# EAGLE design OSO-RING-A2-01 (EAGLE 9.6.2)
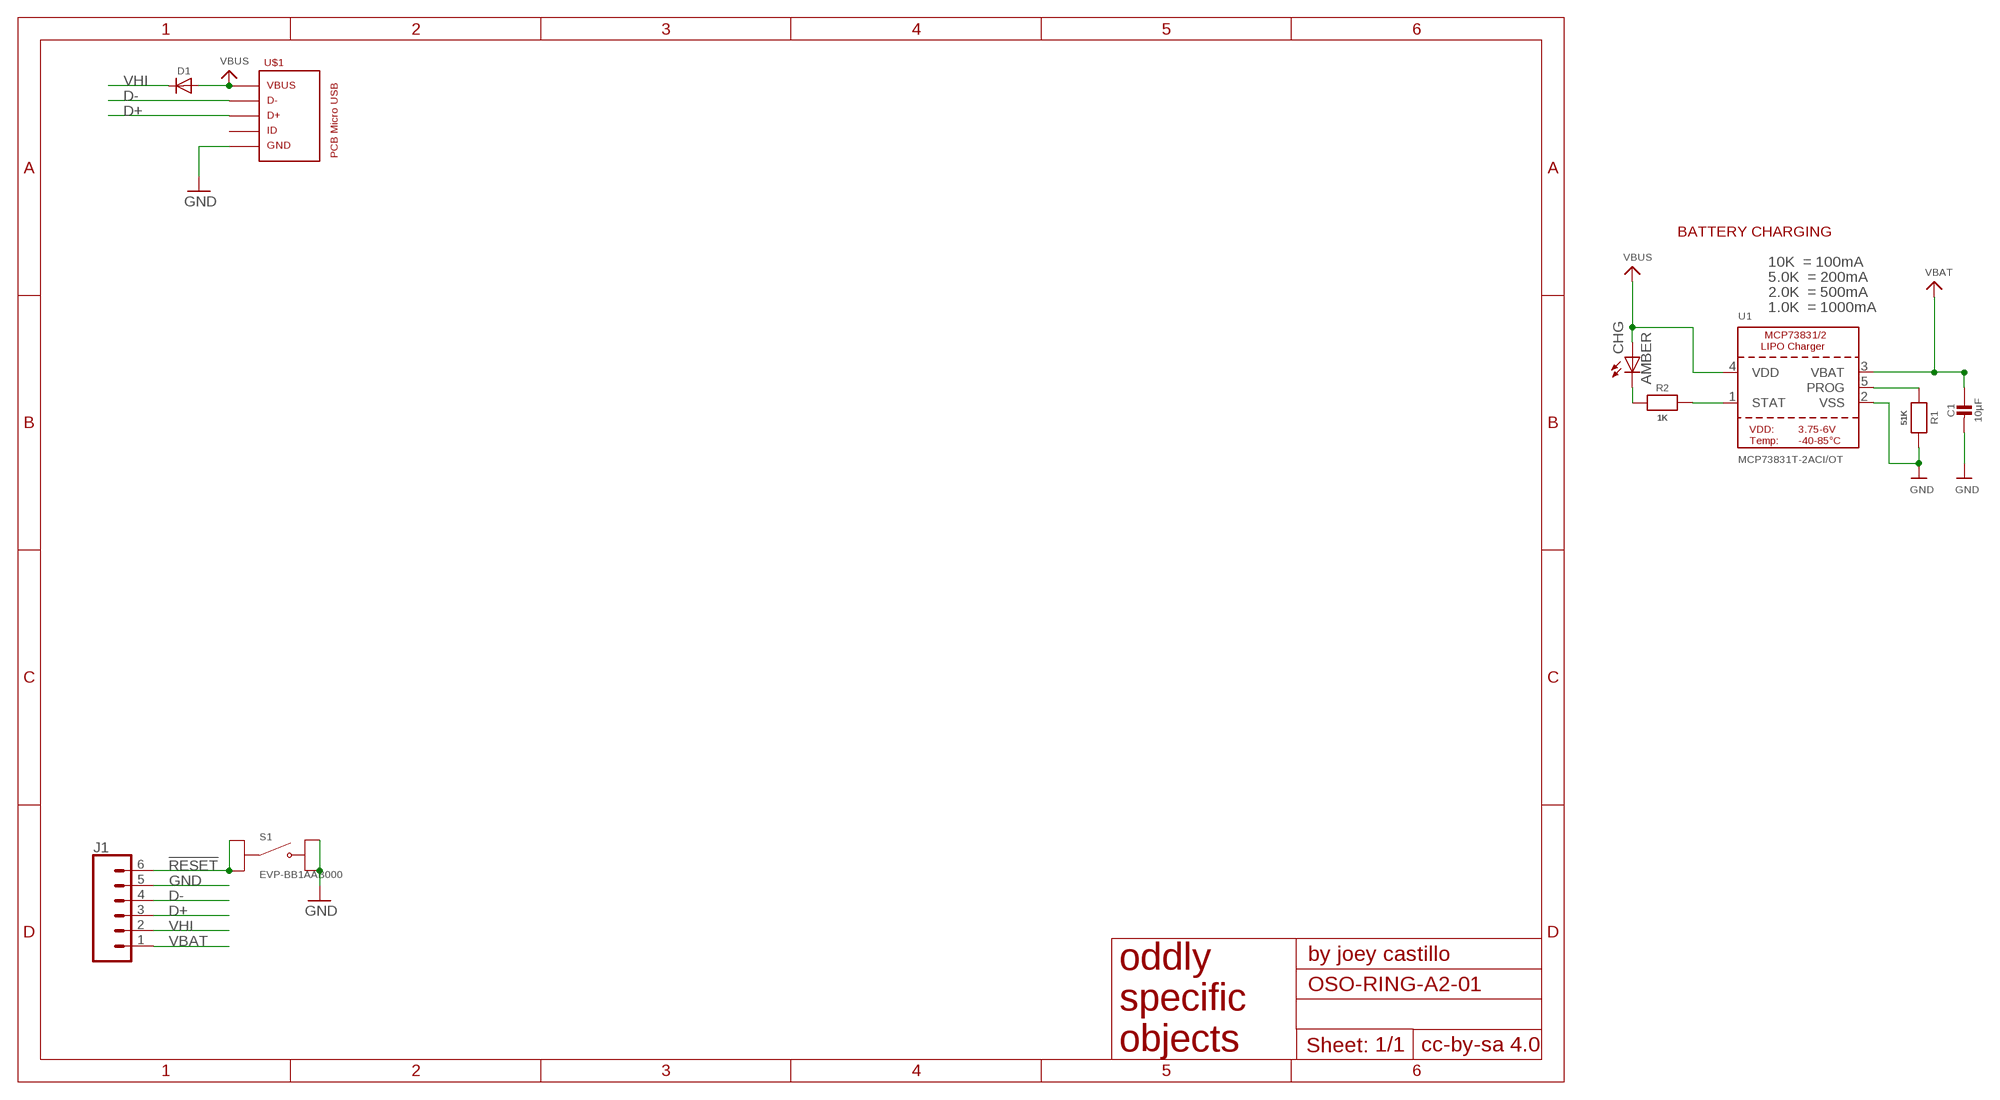
[diagram p0: schematic, sheet 1]

## Parts
C1  10µF  CAP_CERAMIC0603_NO  [0603-NO]
CHG  AMBER  LEDCHIPLED_0805  [CHIPLED_0805]
D1  MICROBUILDER_DIODESOD-323  [MICROBUILDER_SOD-323]
J1  CONN_06SMD-1MM  [1X06-1MM]
R1  51K  RESISTOR_0603_NOOUT  [0603-NO]
R2  1K  RESISTOR_0603_NOOUT  [0603-NO]
S1  EVP-BB1AAB000  [SW_EVP-BB1AAB000]
U1  MCP73831T-2ACI/OT  MCP73831/2  [SOT23-5]
U$1  PCB_MICRO_USB_BSS_100  [USB_TYPE_B_SS_100]

## Nets
!RESET: J1.6 S1.A1 S1.A2
D+: J1.3 U$1.3
D-: J1.4 U$1.2
GND: C1.2 J1.5 R1.2 S1.B1 S1.B2 U1.2(VSS) U$1.5
N$4: CHG.C R2.1
PROG: R1.1 U1.5(PROG)
STAT: R2.2 U1.1(STAT)
VBAT: C1.1 J1.1 U1.3(VBAT)
VBUS: CHG.A D1.A U1.4(VDD) U$1.1
VHI: D1.C J1.2
Unconnected: U$1.4

## Notes on the sheet
- BATTERY CHARGING
- 10K  = 100mA
- 5.0K  = 200mA
- 2.0K  = 500mA
- 1.0K  = 1000mA

## Library data of the parts
C1 = microbuilder:CAP_CERAMIC: Ceramic Capacitors For new designs, use the packages preceded by an '_' character since they are more reliable: The following footprints should be used on most boards: _0402 - Standard footprint for regular board layouts _0603 - Standard footprint for regular board layouts _0805 - Standard footprint for regular board layouts _1206 - Standard footprint for regular board layouts For extremely tight-pitch boards where space is at a premium, the following 'micro-pitch' footprints can be used (smaller pads, no silkscreen outline, etc.): _0402MP - Micro-pitch footprint for very dense/compact boards _0603MP - Micro-pitch footprint for very dense/compact boards _0805MP - Micro-pitch footprint for very dense/compact boards _1206MP - Micro-pitch footprint for very dense/compact boards
CHG = adafruit:LED: LED OSRAM: - CHIPLED LG R971, LG N971, LY N971, LG Q971, LY Q971, LO R971, LY R971 LH N974, LH R974 LS Q976, LO Q976, LY Q976 LO Q996 - Hyper CHIPLED LW Q18S LB Q993, LB Q99A, LB R99A - SideLED LS A670, LO A670, LY A670, LG A670, LP A670 LB A673, LV A673, LT A673, LW A673 LH A674 LY A675 LS A676, LA A676, LO A676, LY A676, LW A676 LS A679, LY A679, LG A679 - Hyper Micro SIDELED® LS Y876, LA Y876, LO Y876, LY Y876 LT Y87S - SmartLED LW L88C, LW L88S LB L89C, LB L89S, LG L890 LS L89K, LO L89K, LY L89K LS L896, LA L896, LO L896, LY L896 - TOPLED LS T670, LO T670, LY T670, LG T670, LP T670 LSG T670, LSP T670, LSY T670, LOP T670, LYG T670 LG T671, LOG T671, LSG T671 LB T673, LV T673, LT T673, LW T673 LH T674 LS T676, LA T676, LO T676, LY T676, LB T676, LH T676, LSB T676, LW T676 LB T67C, LV T67C, LT T67C, LS T67K, LO T67K, LY T67K, LW E67C LS E67B, LA E67B, LO E67B, LY E67B, LB E67C, LV E67C, LT E67C LW T67C LS T679, LY T679, LG T679 LS T770, LO T770, LY T770, LG T770, LP T770 LB T773, LV T773, LT T773, LW T773 LH T774 LS E675, LA E675, LY E675, LS T675 LS T776, LA T776, LO T776, LY T776, LB T776 LHGB T686 LT T68C, LB T68C - Hyper Mini TOPLED® LB M676 - Mini TOPLED Santana® LG M470 LS M47K, LO M47K, LY M47K Source: http://www.osram.convergy.de/
D1 = Adafruit 3.5in 480x320 FeatherWing:MICROBUILDER_DIODE: Diode SMA Model Volts Amps Type Vf Ir Digikey # Notes SSA34-E3 40V 3A Schottky 480mV @ 3A 200uA @ 40V SSA34-E3/61TGITR-ND CDBA120-G 20V 1A Schottky 500mV @ 1A 500uA @ 20V 641-1014-6-ND REEL MBRA210 10V 2A Schottky 350mV @ 2A 700uA @ 10V MBRA210LT3 SOD-123 Model Volts Amps Type Vf Ir Order # Notes BAT54T1G 30V 200mA Schottky 800mV @ 200mA 2uA @ 25V BAT54T1GOSTR-ND B0530W 30V 500mA Schottky 430mV @ 500mA 130uA @ 30V B0530W-FDICT-ND REEL MBR120 20V 1A Schottky 340mV @ 1A MBR120VLSFT1GOSCT-ND SOD-323 Model Volts Amps Type Vf Ir Order # Notes PMEG2005EJ 20V 500mA Schottky 355mV @ 500mA 568-4110-1-ND ZLLS410 10V 570mA Schottky 380mV @ 570mA ZLLS410CT-ND 1N4148WS 75V 150mA Silicon/Simple 1V 1N4148WSFSCT-ND REEL SOD-523 Model Volts Amps Type Vf Ir Order # Notes BAT54XV2 30V 200mA Schottky 0.8V @ 100mA BAT54XV2CT-ND TB751S 30V 30mA Schottky RB751S-40TE61CT-ND SOT23-R/W (R = Solder Paste/Reflow Ovens, W = Hand-Soldering) Model Volts Amps Type Vf Ir Order # Notes BAT54FILM 40V 300mA Schottky 497-7162-1-ND POWERDI-5 Model Volts Amps Type Vf Ir Order # Notes PDS560 60V 5A Schottky 670mV @ 5A 150uA @ 60V PDS560DICT-ND
J1 = SparkFun-Connectors:CONN_06: Multi connection point. Often used as Generic Header-pin footprint for 0.1 inch spaced/style header connections On any of the 0.1 inch spaced packages, you can populate with these: Break Away Headers - Straight <https://www.sparkfun.com/products/116> (PRT-00116) Break Away Male Headers - Right Angle <https://www.sparkfun.com/products/553> (PRT-00553) Female Headers <https://www.sparkfun.com/products/115> (PRT-00115) Break Away Headers - Machine Pin <https://www.sparkfun.com/products/117> (PRT-00117) Break Away Female Headers - Swiss Machine Pin <https://www.sparkfun.com/products/743> (PRT-00743) Arduino Stackable Header - 6 Pin <https://www.sparkfun.com/products/9280> (PRT-09280) For SCREWTERMINALS and SPRING TERMINALS visit here: Screw Terimnals on SparkFun.com <https://www.sparkfun.com/search/results?term=Screw+Terminals> (5mm/3.5mm/2.54mm spacing) This device is also useful as a general connection point to wire up your design to another part of your project. Our various solder wires solder well into these plated through hole pads. Hook-Up Wire - Assortment (Stranded, 22 AWG) <https://www.sparkfun.com/products/11375> (PRT-11375) Hook-Up Wire - Assortment (Solid Core, 22 AWG) <https://www.sparkfun.com/products/11367> (PRT-11367) View the entire wire category on our website here <https://www.sparkfun.com/categories/141>; PROD_ID: CONN-08249; SF_ID: GPS-00579
R1 R2 = microbuilder:RESISTOR: Resistors For new designs, use the packages preceded by an '_' character since they are more reliable: The following footprints should be used on most boards: _0402 - Standard footprint for regular board layouts _0603 - Standard footprint for regular board layouts _0805 - Standard footprint for regular board layouts _1206 - Standard footprint for regular board layouts For extremely tight-pitch boards where space is at a premium, the following 'micro-pitch' footprints can be used (smaller pads, no silkscreen outline, etc.): _0402MP - Micro-pitch footprint for very dense/compact boards _0603MP - Micro-pitch footprint for very dense/compact boards _0805MP - Micro-pitch footprint for very dense/compact boards _1206MP - Micro-pitch footprint for very dense/compact boards
S1 = EVP-BB1AAB000:EVP-BB1AAB000: SWITCH TACTILE SPST-NO 0.02A 15V; DESCRIPTION: Tactile Switch SPST-NO Top Actuated Surface Mount; DIGI-KEY_PART_NUMBER: P124390CT-ND; MF: Panasonic Electronic Components; MP: EVP-BB1AAB000; PACKAGE: None; PURCHASE-URL: https://pricing.snapeda.com/search/part/EVP-BB1AAB000/?ref=eda
U1 = microbuilder:MCP73831/2: MCP73831/2 LIPO Charger VDD: 3.75 - 6V Temp -40 - 85°C Programmable Charge Rate: 15-500mA NOTE: STAT is a tri-state logic output on the MCP73831 and an open-drain output on the MCP73832. SOT23-5 with 4.2V output and tri-state logic on STAT = MCP73831T-2ACI/OT
U$1 = USB_pcb_connectors:PCB_MICRO_USB_B

## Net classes
1 power: width 0.305 mm

## Board
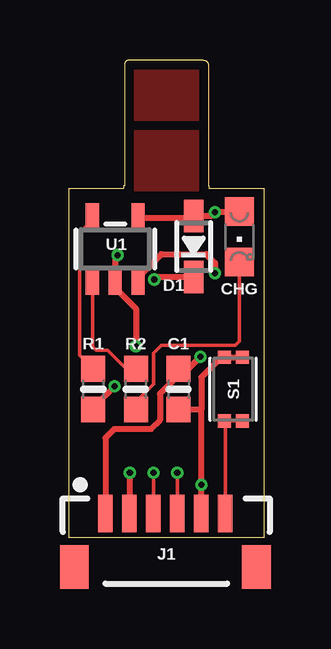
[diagram p1: board, top side]
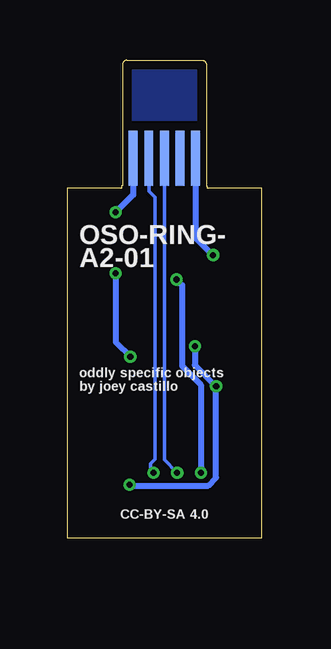
[diagram p2: board, bottom side, seen from below]

Size 8.13 x 19.91 mm. Coordinates in mm from the lower left corner, seen from the top.
Outline: 2.29,14.58 0,14.58 0,0 8.13,0 8.13,14.58 5.84,14.58
Copper layers (1*16): Top 0.035559375mm / dielectric 1.6mm / Bottom 0.035559375mm
Design rules "oshpark-2layer *": minimum track width 6mil, minimum drill 10mil, track to track 6mil, track to pad 6mil, pad to pad 6mil, via to via 6mil, smd to smd 6mil, copper to edge 15mil, drill to drill 6mil, minimum pad ring 5mil, minimum via ring 5mil, stop-mask expansion 2.5mil, vias tented up to drill 12mil, thermal gap 10mil

### Footprints (pad centres in the part's own frame; a part is rotated, then mirrored left to right if it is on the bottom)
0603-NO = smd 1.075 x 1: 1 -0.85,0; 2 0.85,0
CHIPLED_0805 = smd 1.2 x 1.2: A 0,-1.05; C 0,1.05
MICROBUILDER_SOD-323 = smd 1.35 x 0.8: A 1.27,0; C -1.27,0
1X06-1MM = smd 0.6 x 1.55: 1 -2.54,1.27; 2 -1.54,1.27; 3 -0.54,1.27; 4 0.46,1.27; 5 1.46,1.27; 6 2.46,1.27 | smd 1.2 x 1.8: P$1 -3.84,-0.955; P$2 3.76,-0.955
SW_EVP-BB1AAB000 = smd 0.55 x 0.55: A1 -1.325,0.375; A2 -1.325,-0.375; B1 1.325,0.375; B2 1.325,-0.375
SOT23-5 = smd 0.55 x 1.2: 1 -0.95,-1.3; 2 0,-1.3; 3 0.95,-1.3; 4 0.95,1.3; 5 -0.95,1.3
USB_TYPE_B_SS_100 = smd 0.37 x 2.3: 1 -1.3,-1.55; 2 -0.65,-1.55; 3 0,-1.55; 4 0.65,-1.55; 5 1.3,-1.55

### Placement (x,y rotation side)
C1  4.57,6.2 270 top
CHG  7.11,12.55 180 top
D1  5.21,12.14 90 top
J1  4.06,-0.25 0 top
R1  1.02,6.2 270 top
R2  2.79,6.2 90 top
S1  6.86,6.2 90 top
U1  1.93,12.04 0 top
U$1  4.06,17.37 0 bottom

### Tracks (layer width: path | path; a pad name or v marks a point on that pad's centre or on a via)
!RESET
  Top 0.152: J1.6 6.52,4.83 S1.A1 S1.A2
BOTTOM
  pour Bottom: 2.29,19.91 5.84,19.91 5.84,17.5 2.29,17.5
D+  (via drill 0.25)
  Top 0.152: J1.3 v3.52,2.71 v3.53,2.72
  Bottom 0.152: U$1.3 4.06,3.25 v3.53,2.72
D-  (via drill 0.25)
  Top 0.152: J1.4 v4.52,2.71 v4.52,2.72
  Bottom 0.152: U$1.2 4.71,14.45 4.46,14.2 4.46,3.28 4.64,3.1 4.64,2.83 v4.52,2.72
GND  (via drill 0.25)
  Top 0.254: J1.5 v5.52,2.21 5.52,5.35 | 5.52,5.35 5.52,6.69 6.36,7.52 S1.B1 S1.B2 | 5.52,5.35 C1.2 | v2.79,7.99 2.79,9.56 1.93,10.42 U1.2 1.93,11.68 v2.03,11.79 | v1.91,6.32 1.02,5.44 R1.2
  Bottom 0.254: v2.79,7.99 2.79,7.21 v1.91,6.32 | v1.91,6.32 | v5.52,2.21 5.5,2.18 2.24,2.18 1.91,2.51 v1.91,6.32 | U$1.5 2.76,12.52 v2.03,11.79
N$4
  Top 0.152: R2.1 2.79,5.68 3.52,6.41 3.52,7.69 3.86,8.03 6.94,8.03 7.11,8.2 CHG.C
PROG
  Top 0.152: R1.1 0.46,7.61 0.46,12.73 0.98,13.25 U1.5
STAT
  Top 0.152: U1.1 0.98,7.98 1.14,7.81 1.61,7.81 2.38,7.05 R2.2
TOP1
  pour Top: 5.84,16.87 2.29,16.87 2.29,14.58 5.84,14.58
TOP2
  pour Top: 5.84,19.91 2.29,19.91 2.29,17.5 5.84,17.5
VBAT  (via drill 0.25)
  Top 0.254: J1.1 1.52,4.17 1.89,4.53 3.41,4.53 3.43,4.55 3.79,4.91 3.79,6 4.57,6.78 C1.1 4.99,7.05 v5.49,7.54 | U1.3 3.03,10.89 3.03,10.99 3.86,11.83 5.72,11.83 6.1,11.45 v6.1,11.02
  Bottom 0.254: v6.1,11.02 6.1,8.15 v5.49,7.54
VBUS  (via drill 0.25)
  Top 0.254: CHG.A 7.08,13.56 v6.1,13.56 5.94,13.41 D1.A 5.13,13.34 U1.4
  Bottom 0.254: U$1.1 5.36,14.3 v6.1,13.56
VHI  (via drill 0.25)
  Top 0.254: v2.54,2.72 2.54,1.03 J1.2 | D1.C 3.66,10.87 v3.56,10.77
  Bottom 0.254: v3.56,10.77 3.33,10.54 3.33,7.17 2.54,6.38 v2.54,2.72

### Text on the board
bPlace: OSO-RING- / A2-01 | oddly specific objects / by joey castillo | CC-BY-SA 4.0